# EAGLE design child (EAGLE 8.6.0)
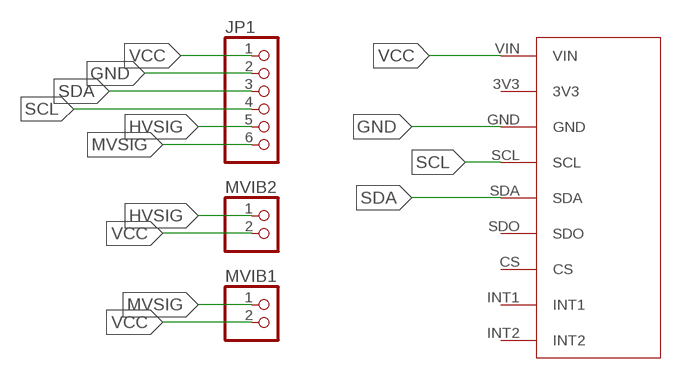
[diagram p0: schematic, sheet 1]

## Parts
ACCEL  ADAFRUITADXL343  [ADAFRUITADXL343]
JP1  PINHD-1X6  [1X06]
MVIB1  PINHD-1X2  [1X02]
MVIB2  PINHD-1X2  [1X02]

## Nets
GND: ACCEL.GND JP1.2
HVSIG: JP1.5 MVIB2.1
MVSIG: JP1.6 MVIB1.1
SCL: ACCEL.SCL JP1.4
SDA: ACCEL.SDA JP1.3
VCC: ACCEL.VIN JP1.1 MVIB1.2 MVIB2.2
Unconnected: ACCEL.3V3 ACCEL.CS ACCEL.INT1 ACCEL.INT2 ACCEL.SDO

## Library data of the parts
ACCEL = mine:ADAFRUITADXL343
JP1 = pinhead:PINHD-1X6: PIN HEADER
MVIB1 MVIB2 = pinhead:PINHD-1X2: PIN HEADER

## Net classes
0 default: width 0.813 mm, drill 0.813 mm, clearance 0.813 mm

## Board
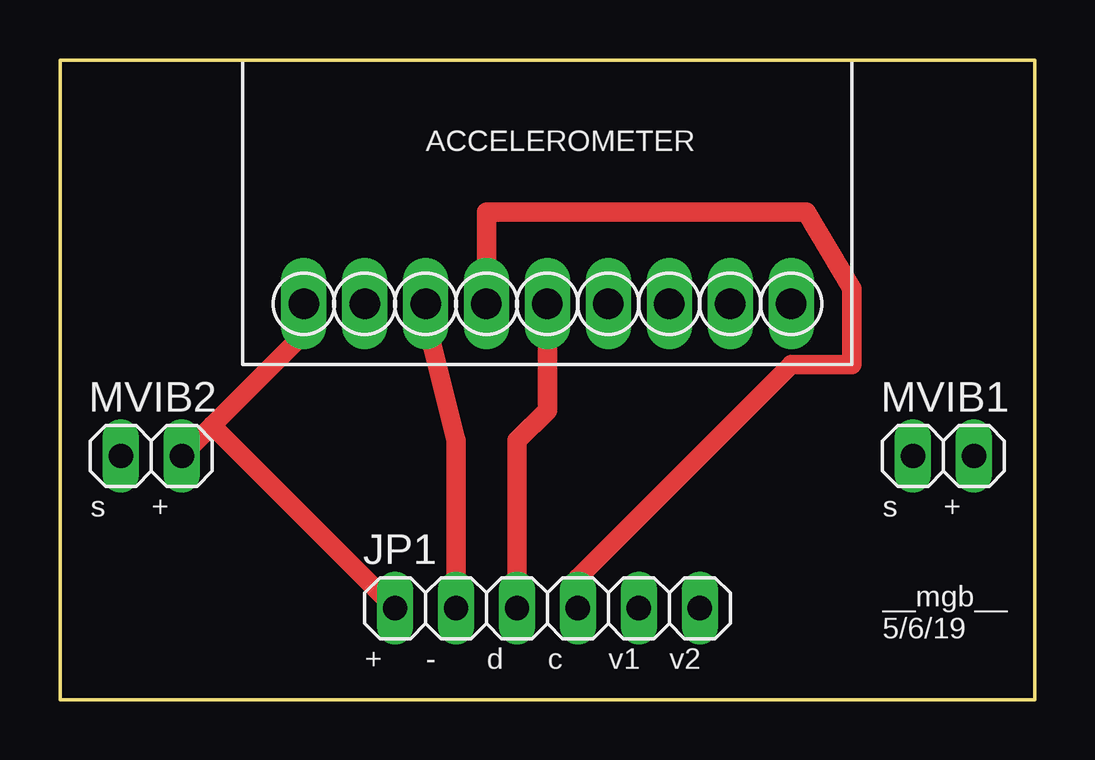
[diagram p1: board, top side]
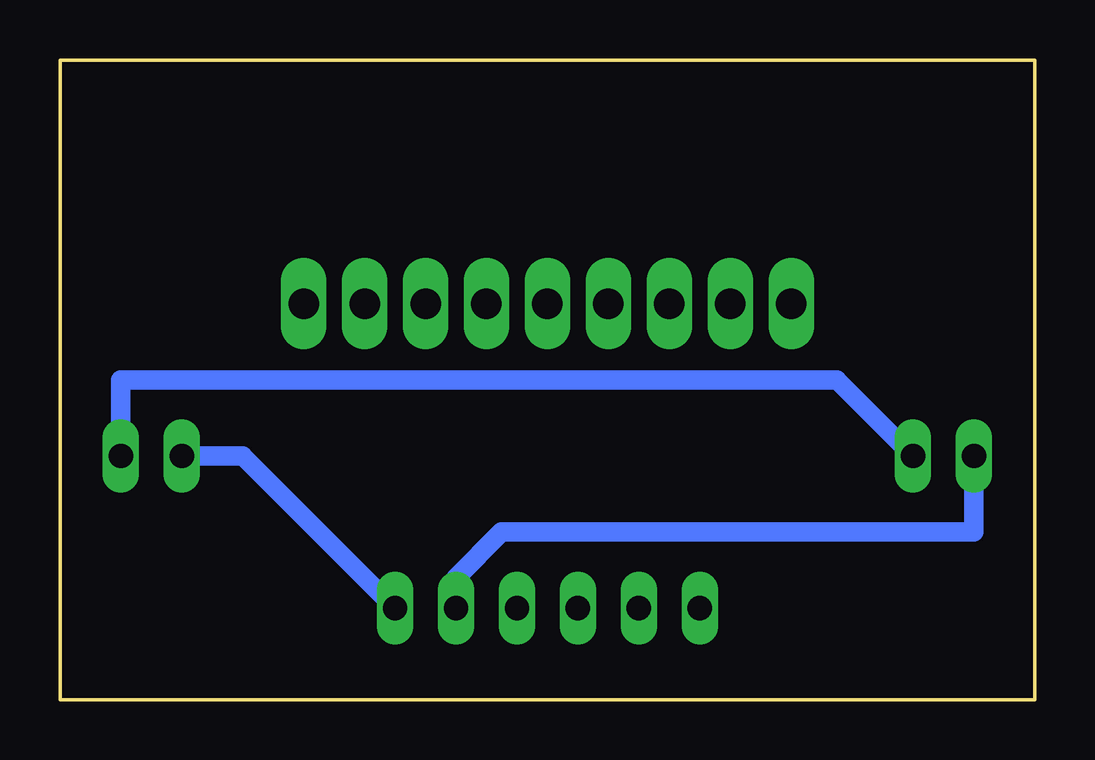
[diagram p2: board, bottom side, seen from below]

Size 40.64 x 26.67 mm. Coordinates in mm from the lower left corner, seen from the top.
Outline: 0,26.67 0,0 40.64,0 40.64,26.67 0,26.67
Copper layers (1*16): Top 0.035mm / dielectric 1.5mm / Bottom 0.035mm
Design rules "default": minimum track width 6mil, minimum drill 0.35mm, track to track 6mil, track to pad 6mil, pad to pad 6mil, via to via 6mil, smd to smd 6mil, copper to edge 40mil, drill to drill 6mil, minimum pad ring 10mil, minimum via ring 8mil, stop-mask expansion 4mil, vias tented up to drill 0mil, thermal gap 10mil

### Footprints (pad centres in the part's own frame; a part is rotated, then mirrored left to right if it is on the bottom)
ADAFRUITADXL343 = drill 1.27 long: 3V3 -10.16,0; CS 2.54,0; GND -7.62,0; INT1 5.08,0; INT2 7.62,0; SCL -5.08,0; SDA -2.54,0; SDO 0,0; VIN -12.7,0
1X06 = drill 1.016 long: 1 -6.35,0; 2 -3.81,0; 3 -1.27,0; 4 1.27,0; 5 3.81,0; 6 6.35,0
1X02 = drill 1.016 long: 1 -1.27,0; 2 1.27,0

### Placement (x,y rotation side)
ACCEL  22.86,16.51 0 top
JP1  20.32,3.81 0 top
MVIB1  36.83,10.16 0 top
MVIB2  3.81,10.16 0 top

### Tracks (layer width: path | path; a pad name or v marks a point on that pad's centre or on a via)
GND
  Top 0.813: JP1.2 16.51,10.8 15.24,15.88 ACCEL.GND
HVSIG
  Bottom 0.813: MVIB2.1 2.54,6.98 22.23,6.98 24.13,5.08 JP1.5
MVSIG
  Bottom 0.813: JP1.6 33.02,10.16 MVIB1.1
SCL
  Top 0.813: JP1.4 21.59,5.08 30.48,13.97 33.02,13.97 33.02,17.14 31.11,20.32 17.78,20.32 ACCEL.SCL
SDA
  Top 0.813: JP1.3 19.05,10.8 20.32,12.06 ACCEL.SDA
VCC
  Top 0.813: 6.35,11.43 10.16,15.24 ACCEL.VIN | 6.35,11.43 MVIB2.2 | 6.35,11.43 JP1.1
  Bottom 0.813: MVIB1.2 38.1,13.34 8.26,13.34 MVIB2.2

### Text on the board
tNames: ACCELEROMETER | s | + | s | + | __mgb__ / 5/6/19 | + | - | d | c | v1 | v2